# Altium schematic sheet 各路供电与接口.SchDoc
size A4
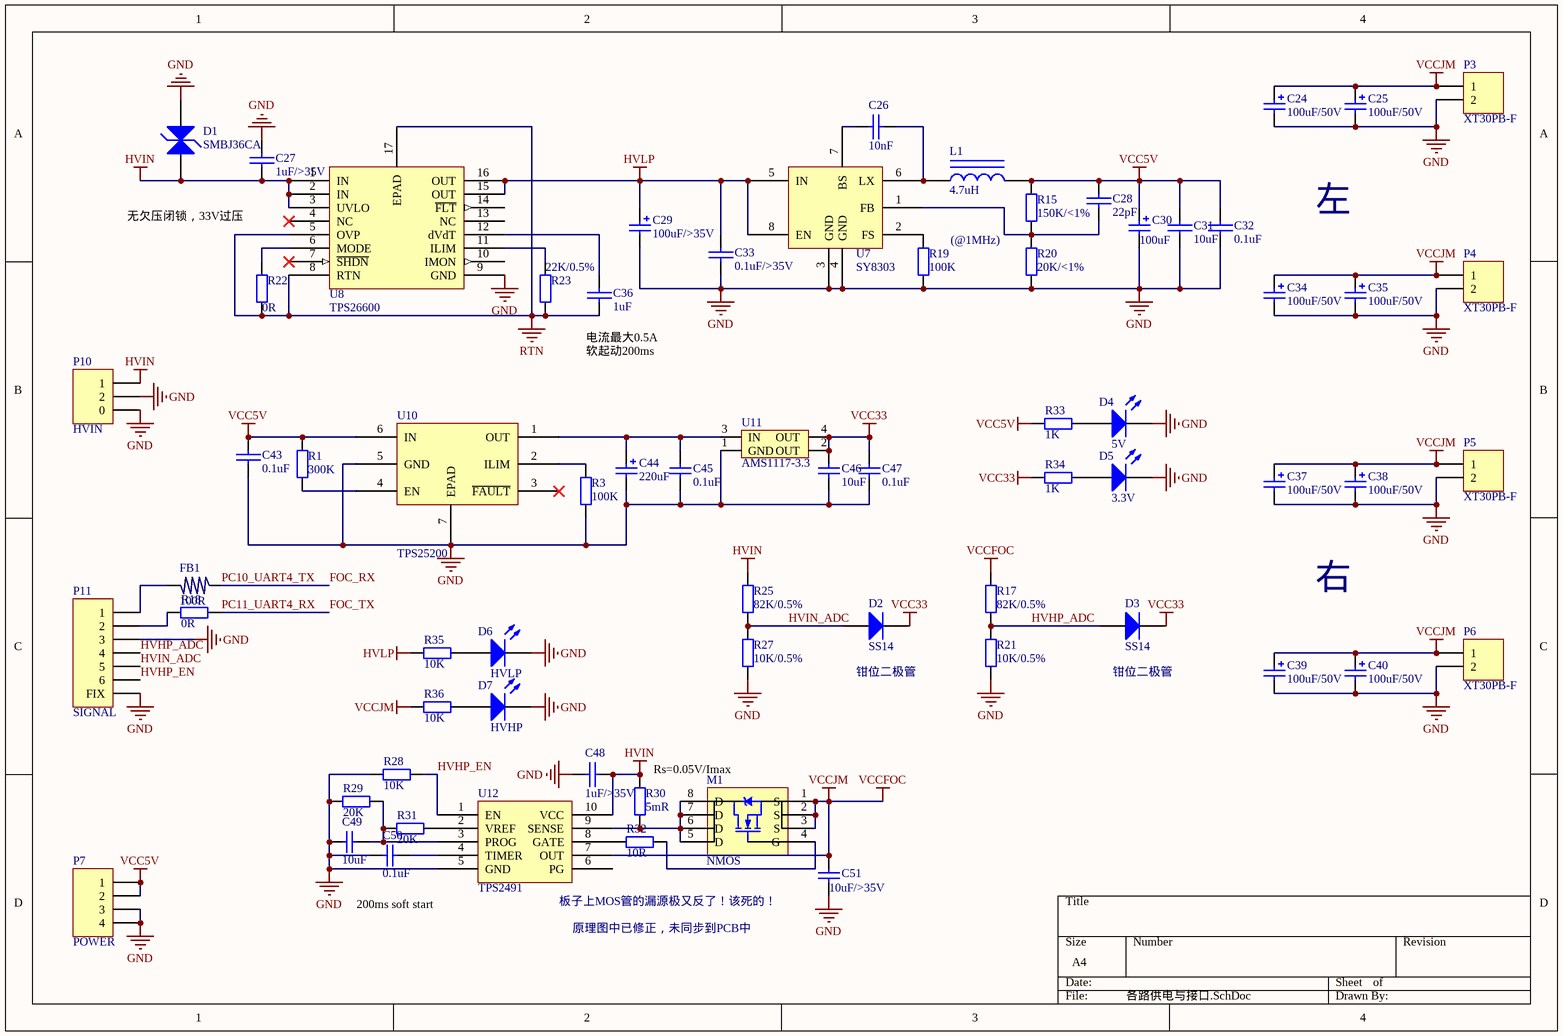
[diagram p0: 各路供电与接口.SchDoc]

## Parts
C24  100uF/50V  [CS 6*6 - R]
C25  100uF/50V  [CS 6*6 - R]
C26  10nF  [C0805_M]
C27  1uF/>35V  [C0805_M]
C28  22pF  [C0805_M]
C29  100uF/>35V  [CS 6*6 - R]
C30  100uF  [CS 6*6 - R]
C31  10uF  [C0805_M]
C32  0.1uF  [C0805_M]
C33  0.1uF/>35V  [C0805_M]
C34  100uF/50V  [CS 6*6 - R]
C35  100uF/50V  [CS 6*6 - R]
C36  1uF  [C0805_M]
C37  100uF/50V  [CS 6*6 - R]
C38  100uF/50V  [CS 6*6 - R]
C39  100uF/50V  [CS 6*6 - R]
C40  100uF/50V  [CS 6*6 - R]
C43  0.1uF  [C0805_M]
C44  220uF  [CS 6*6 - R]
C45  0.1uF  [C0805_M]
C46  10uF  [C0805_M]
C47  0.1uF  [C0805_M]
C48  1uF/>35V  [C0805_M]
C49  10uF  [C0805_M]
C50  0.1uF  [C0805_M]
C51  10uF/>35V  [C0805_M]
D1  SMBJ36CA  [SMB]
D2  SS14  [SOD-323]
D3  SS14  [SOD-323]
D4  5V  [LED0805_G]
D5  3.3V  [LED0805_G]
D6  HVLP  [LED0805_G]
D7  HVHP  [LED0805_G]
FB1  100R  [R0805_M]
L1  4.7uH  [L-SMD-0630]
M1  NMOS  [DFN8L-5X6]
P3  XT30PB-F  [XT30PB-F]
P4  XT30PB-F  [XT30PB-F]
P5  XT30PB-F  [XT30PB-F]
P6  XT30PB-F  [XT30PB-F]
P7  POWER  [XH2.54-LI-4P]
P10  HVIN  [XT60PW-M]
P11  SIGNAL  [SH1.0-LT-6P]
R1  300K  [R0805_M]
R3  100K  [R0805_M]
R15  150K/<1%  [R0805_M]
R17  82K/0.5%  [R0805_M]
R18  0R  [R0805_M]
R19  100K  [R0805_M]
R20  20K/<1%  [R0805_M]
R21  10K/0.5%  [R0805_M]
R22  0R  [R0805_M]
R23  22K/0.5%  [R0805_M]
R25  82K/0.5%  [R0805_M]
R27  10K/0.5%  [R0805_M]
R28  10K  [R0805_M]
R29  20K  [R0805_M]
R30  5mR  [R2512_M]
R31  20K  [R0805_M]
R32  10R  [R0805_M]
R33  1K  [R0805_M]
R34  1K  [R0805_M]
R35  10K  [R0805_M]
R36  10K  [R0805_M]
U7  SY8303  [SOT23-8L]
U8  TPS26600  [ETSSOP16_M]
U10  TPS25200  [WSON-6]
U11  AMS1117-3.3  [SOT223_M]
U12  TPS2491  [VSSOP10]

## Nets
GND: C24.2 C25.2 C27.2 C29.2 C30.2 C31.1 C32.1 C33.1 C34.2 C35.2 C37.2 C38.2 C39.2 C40.2 C43.2 C44.2 C45.1 C46.1 C47.1 C48.1 C49.1 C50.1 C51.1 D1.1(A) D4.2(K) D5.2(K) D6.2(K) D7.2(K) P3.2 P4.2 P5.2 P6.2 P7.3 P7.4 P10.0 P10.2 P11.0(FIX) P11.3 R3.1 R19.2 R20.2 R21.2 R27.2 R28.2 R29.2 U7.3(GND) U7.4(GND) U8.9(GND) U10.5(GND) U10.7(EPAD) U11.1(GND) U12.5(GND)
HVIN: C27.1 C48.2 D1.2(K) P10.1 R25.1 R30.2 U8.1(IN) U8.2(IN) U8.3(UVLO) U12.10(VCC)
HVLP: C29.1 C33.2 R35.2 U7.5(IN) U7.8(EN) U8.15(OUT) U8.16(OUT)
RTN: C36.2 R22.2 R23.2 U8.5(OVP) U8.8(RTN) U8.17(EPAD)
VCC5V: C28.2 C30.1 C31.2 C32.2 C43.1 L1.2 P7.1 P7.2 R1.2 R15.1 R33.2 U10.6(IN)
VCC33: C46.2 C47.2 D2.2(K) D3.2(K) R34.2 U11.2(OUT) U11.4(OUT)
VCCFOC: C24.1 C25.1 C34.1 C35.1 C37.1 C38.1 C39.1 C40.1 C51.2 M1.1(S) M1.2(S) M1.3(S) P3.1 P4.1 P5.1 P6.1 R17.1 R36.2 U12.7(OUT)  [also labelled VCCJM]
FOC_RX: FB1.1  [also labelled PC10_UART4_TX]
FOC_TX: R18.1  [also labelled PC11_UART4_RX]
HVHP_ADC: D3.1(A) P11.4 R17.2 R21.1
HVHP_EN: P11.6 R28.1 U12.1(EN)
HVIN_ADC: D2.1(A) P11.5 R25.2 R27.1
NetC26_1: C26.1 U7.7(BS)
NetC26_2: C26.2 L1.1 U7.6(LX)
NetC28_1: C28.1 R15.2 R20.1 U7.1(FB)
NetC36_1: C36.1 U8.12(dVdT)
NetC44_1: C44.1 C45.2 U10.1(OUT) U11.3(IN)
NetC49_2: C49.2 R29.1 R31.2 U12.3(PROG)
NetC50_2: C50.2 U12.4(TIMER)
NetD4_1: D4.1(A) R33.1
NetD5_1: D5.1(A) R34.1
NetD6_1: D6.1(A) R35.1
NetD7_1: D7.1(A) R36.1
NetFB1_2: FB1.2 P11.1
NetM1_4: M1.4(G) R32.1
NetM1_5: M1.5(D) M1.6(D) M1.7(D) M1.8(D) R30.1 U12.9(SENSE)
NetP11_2: P11.2 R18.2
NetR1_1: R1.1 U10.4(EN)
NetR3_2: R3.2 U10.2(ILIM)
NetR19_1: R19.1 U7.2(FS)
NetR22_1: R22.1 U8.6(MODE)
NetR23_1: R23.1 U8.11(ILIM)
NetR31_1: R31.1 U12.2(VREF)
NetR32_2: R32.2 U12.8(GATE)

Not connected (* = marked no-connect by the designer): U8 4(NC)* 7(~{SHDN})* 10(IMON) 13(NC) 14(~{FLT}); U10 3(~{FAULT})*; U12 6(PG)

## Notes on the sheet
- 无欠压闭锁，33V过压
- (@1MHz)
- 左
- (near C36) 电流最大0.5A
  软起动200ms
- 右
- (near D2) 钳位二极管
- (near D3) 钳位二极管
- Rs=0.05V/Imax
- 200ms soft start
- (near U12) 板子上MOS管的漏源极又反了！该死的！
- 原理图中已修正，未同步到PCB中

## Library data of the parts
C24 C25 C34 C35 C37-C40 = Cap Pol2: Low ESR required; Published: 8-Jun-2000; LatestRevisionDate: 17-Jul-2002; LatestRevisionNote: Re-released for DXP Platform.; PackageReference: POLAR0.8; Publisher: Altium Limited; PackageDescription: Polarized Capacitor; 2 Leads
C26-C28 C31-C33 C36 C43 C48 = CAP: Capacitor
C29 C30 = Cap Pol2: 固态电容; Published: 8-Jun-2000; LatestRevisionDate: 17-Jul-2002; LatestRevisionNote: Re-released for DXP Platform.; PackageReference: POLAR0.8; Publisher: Altium Limited; PackageDescription: Polarized Capacitor; 2 Leads
C44 = Cap Pol2: Polarized Capacitor (Axial); Value: 100pF; Published: 8-Jun-2000; LatestRevisionDate: 17-Jul-2002; LatestRevisionNote: Re-released for DXP Platform.; PackageReference: POLAR0.8; Publisher: Altium Limited; PackageDescription: Polarized Capacitor; 2 Leads
C45-C47 C49 C50 = Cap: Capacitor; Value: 100pF; Published: 8-Jun-2000; LatestRevisionDate: 17-Jul-2002; LatestRevisionNote: Re-released for DXP Platform.; PackageReference: RAD-0.3; Publisher: Altium Limited; PackageDescription: Radial Cap, Thru-Hole; 2 Leads; 0.3 in Pin Spacing
C51 = Cap: Capacitor; Published: 8-Jun-2000; LatestRevisionDate: 17-Jul-2002; LatestRevisionNote: Re-released for DXP Platform.; PackageReference: RAD-0.3; Publisher: Altium Limited; PackageDescription: Radial Cap, Thru-Hole; 2 Leads; 0.3 in Pin Spacing
D1 = TVS
D2 D3 = Diode: Default Diode; Published: 8-Jun-2000; LatestRevisionDate: 17-Jul-2002; LatestRevisionNote: Re-released for DXP Platform.; PackageVersion: Sep-1996; PackageReference: SMC; Publisher: Altium Limited; PackageDescription: DO-214-AB/SMC; 2 C-Bend Leads; Body 7.9 x 5.9 mm, inc. leads (LxW); Code_JEDEC: DO-214-AB
D4-D7 = LED1: Typical RED GaAs LED; Published: 8-Jun-2000; LatestRevisionDate: 08-Jul-2005; LatestRevisionNote: Mech Layer 1 removed.; PackageReference: LED-1; Publisher: Altium Limited; PackageDescription: LED; 2 Leads
FB1 = L
L1 = Inductor Iron: Magnetic-Core Inductor; Value: 10mH; Published: 24-Mar-1999; LatestRevisionDate: 17-Jul-2002; LatestRevisionNote: Re-released for DXP Platform.; PackageReference: AXIAL-0.9; Publisher: Altium Limited; PackageDescription: Axial Device, Thru-Hole; 2 Leads; 0.9 in Pin Spacing
M1 = NMOS_IC
P3-P6 = Header 2: Header, 2-Pin; LatestRevisionDate: 17-Jul-2002; LatestRevisionNote: Re-released for DXP Platform.; Publisher: Altium Limited
P7 = Header 4: Header, 4-Pin; LatestRevisionDate: 17-Jul-2002; LatestRevisionNote: Re-released for DXP Platform.; Publisher: Altium Limited
P10 = Header 3: Header, 3-Pin; LatestRevisionDate: 17-Jul-2002; LatestRevisionNote: Re-released for DXP Platform.; Publisher: Altium Limited
P11 = Header 7: Header, 7-Pin; LatestRevisionDate: 17-Jul-2002; LatestRevisionNote: Re-released for DXP Platform.; Publisher: Altium Limited
R1 R3 R15 R17-R23 R25 R27-R32 R35 R36 = Res2: Resistor; Value: 1K; Published: 8-Jun-2000; LatestRevisionDate: 17-Jul-2002; LatestRevisionNote: Re-released for DXP Platform.; PackageReference: AXIAL-0.4; Publisher: Altium Limited; PackageDescription: Axial Device, Thru-Hole; 2 Leads; 0.4 in Pin Spacing
R33 R34 = Res2: Resistor; Published: 8-Jun-2000; LatestRevisionDate: 17-Jul-2002; LatestRevisionNote: Re-released for DXP Platform.; PackageReference: AXIAL-0.4; Publisher: Altium Limited; PackageDescription: Axial Device, Thru-Hole; 2 Leads; 0.4 in Pin Spacing; Value: 1K
U11 = AMS1117